# EAGLE design attiny85_jig (EAGLE 9.3.0)
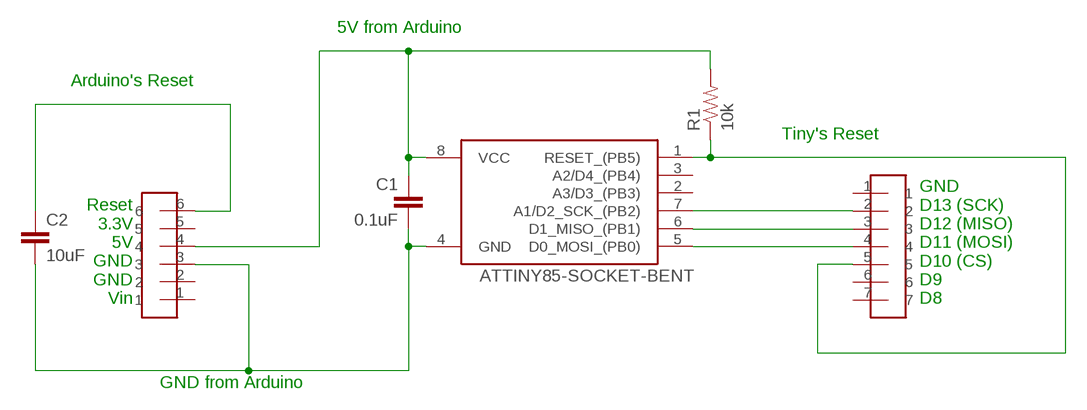
[diagram p0: schematic, sheet 1]

## Parts
C1  0.1uF  CAP-0805  [0805]
C2  10uF  CAP-0805  [0805]
R1  10k  RESISTOR-0805  [0805]
U$1  ATTINY85-SOCKET-BENT  [SOCKET-8PIN-BENT]
U$2  HEADER-6  [HEADER-6]
U$3  HEADER-7  [HEADER-7]

## Nets
5V: C1.1 R1.2 U$1.8(VCC) U$2.4
ARDUINO_RESET: C2.1 U$2.6
GND: C1.2 C2.2 U$1.4(GND) U$2.3
MISO: U$1.6(D1_MISO_(PB1)) U$3.3
MOSI: U$1.5(D0_MOSI_(PB0)) U$3.4
SCK: U$1.7(A1/D2_SCK_(PB2)) U$3.2
TINY_RESET: R1.1 U$1.1(RESET_(PB5)) U$3.5
Unconnected: U$1.2(A3/D3_(PB3)) U$1.3(A2/D4_(PB4)) U$2.1 U$2.2 U$2.5 U$3.1 U$3.6 U$3.7

## Notes on the sheet
- 5V from Arduino
- Arduino's Reset
- Tiny's Reset
- Reset
  3.3V
  5V
  GND
  GND
  Vin
- GND
  D13 (SCK)
  D12 (MISO)
  D11 (MOSI)
  D10 (CS)
  D9
  D8
- GND from Arduino

## Library data of the parts
C1 C2 = homemade-hardware:CAP: Capacitor Standard 0603 ceramic capacitor, and 0.1" leaded capacitor.
R1 = homemade-hardware:RESISTOR: Resistor Basic schematic elements and footprints for 0603, 1206, and PTH resistors.
U$1 = homemade-hardware:ATTINY85
U$2 = homemade-hardware:HEADER-6
U$3 = homemade-hardware:HEADER-7

## Board
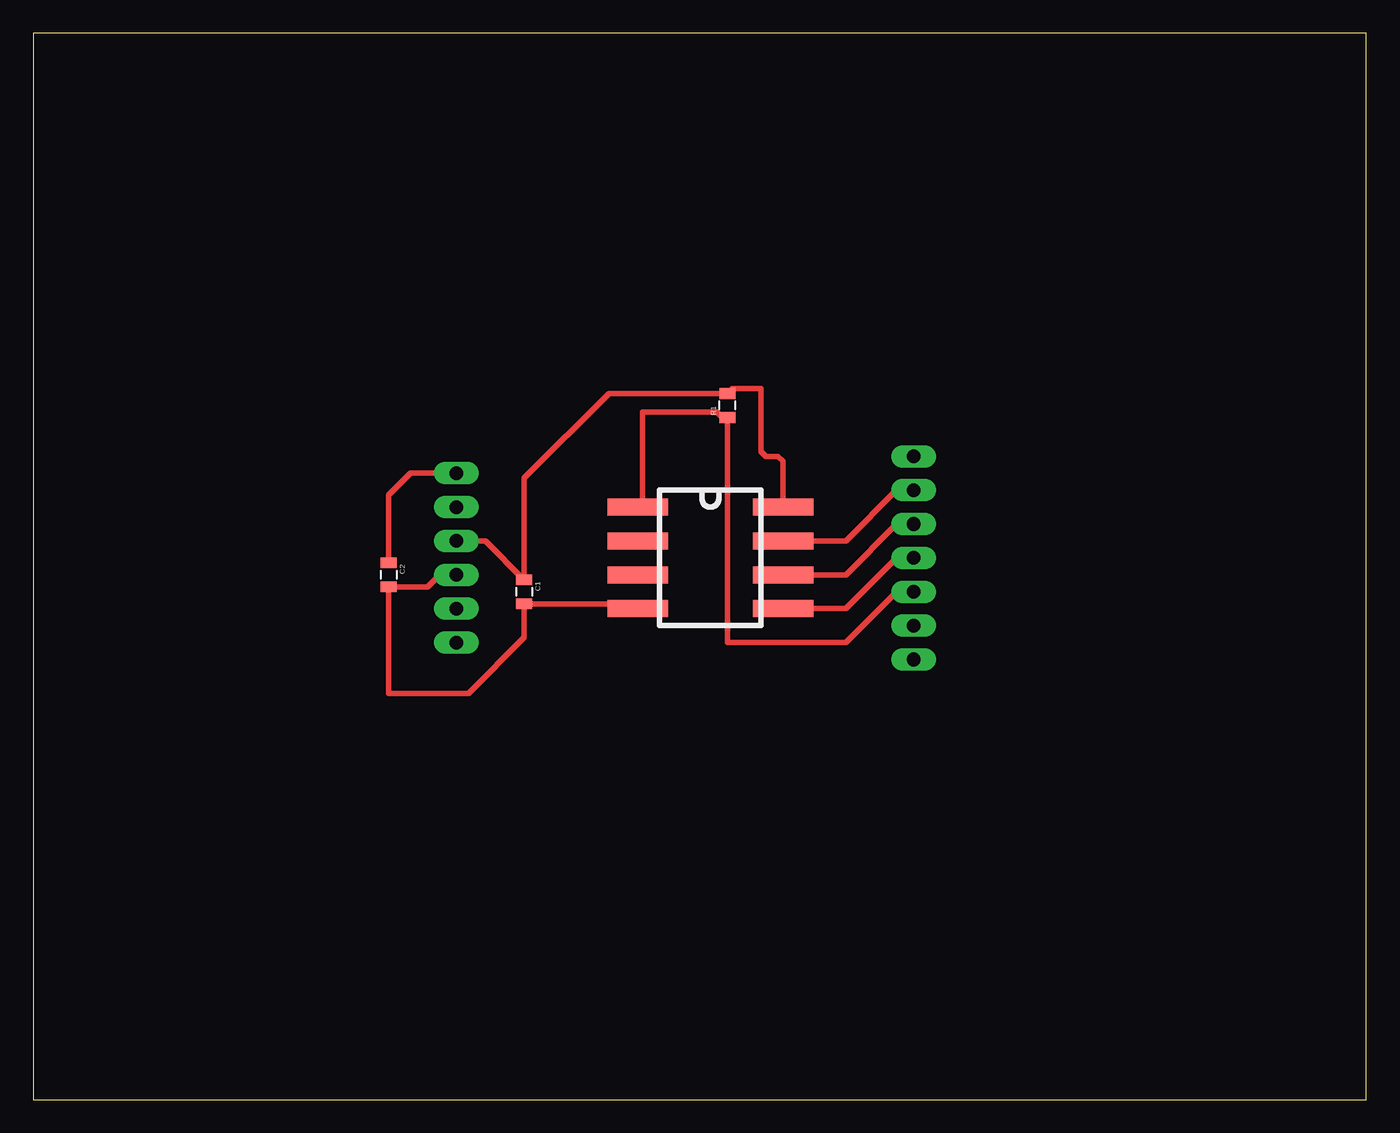
[diagram p1: board, top side]

Size 100 x 80 mm. Coordinates in mm from the lower left corner, seen from the top.
Outline: 0,0 100,0 100,80 0,80 0,0
Copper layers (1*16): Top 0.035mm / dielectric 1.5mm / Bottom 0.035mm
Design rules "default": minimum track width 16mil, minimum drill 0.8mm, track to track 0.8mm, track to pad 0.8mm, pad to pad 0.8mm, via to via 0.8mm, smd to smd 0mil, copper to edge 1mil, drill to drill 1mil, minimum pad ring 10mil, minimum via ring 10mil, stop-mask expansion 1mil, vias tented up to drill 30mil, thermal gap 10mil

### Footprints (pad centres in the part's own frame; a part is rotated, then mirrored left to right if it is on the bottom)
0805 = smd 0.8 x 1.2: 1 -0.9,0; 2 0.9,0
SOCKET-8PIN-BENT = smd 4.54 x 1.27: 1 -5.445,3.81; 2 -5.445,1.27; 3 -5.445,-1.27; 4 -5.445,-3.81; 5 5.445,-3.81; 6 5.445,-1.27; 7 5.445,1.27; 8 5.445,3.81
HEADER-6 = drill 1.016 pad 1.676 long: 1 0,0; 2 0,2.54; 3 0,5.08; 4 0,7.62; 5 0,10.16; 6 0,12.7
HEADER-7 = drill 1.016 pad 1.676 long: 1 0,0; 2 0,2.54; 3 0,5.08; 4 0,7.62; 5 0,10.16; 6 0,12.7; 7 0,15.24

### Placement (x,y rotation side)
C1  36.83,38.1 270 top
C2  26.67,39.37 270 top
R1  52.07,52.07 90 top
U$1  50.8,40.64 0 top
U$2  31.75,34.29 0 top
U$3  66.04,48.26 180 top

### Tracks (layer width: path | path; a pad name or v marks a point on that pad's centre or on a via)
5V
  Top 0.406: C1.1 | U$1.8 56.24,47.9 55.88,48.26 54.98,48.26 54.61,48.63 54.61,53.34 52.44,53.34 R1.2 43.18,52.97 36.83,46.62 C1.1 | C1.1 33.92,41.91 U$2.4
ARDUINO_RESET
  Top 0.406: U$2.6 28.31,46.99 26.67,45.35 C2.1
GND
  Top 0.406: U$1.4 44.98,37.2 C1.2 36.83,34.66 32.66,30.48 26.67,30.48 C2.2 29.58,38.47 30.48,39.37 U$2.3
MISO
  Top 0.406: U$1.6 60.96,39.37 64.77,43.18 U$3.3
MOSI
  Top 0.406: U$1.5 60.96,36.83 64.77,40.64 U$3.4
SCK
  Top 0.406: U$1.7 60.96,41.91 64.77,45.72 U$3.2
TINY_RESET
  Top 0.406: U$1.1 45.72,44.81 45.72,51.57 51.3,51.57 52.07,50.8 | R1.1 52.07,50.8 | 52.07,50.8 52.07,34.29 60.96,34.29 64.77,38.1 U$3.5